# EAGLE design 3v3 (EAGLE 7.5.0)
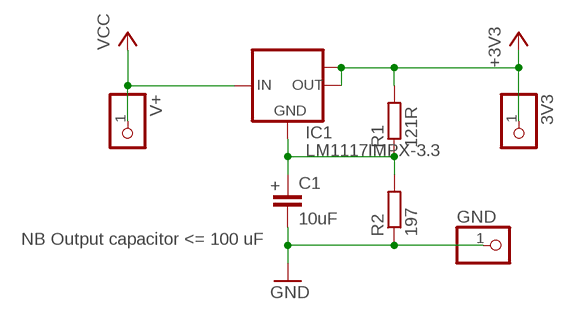
[diagram p0: schematic, sheet 1]

## Parts
3V3  PINHD-1X1  [1X01]
C1  10uF  C-EUC0805  [C0805]
GND  PINHD-1X1  [1X01]
IC1  LM1117IMPX-3.3  [SOT223]
R1  121R  R-EU_M0805  [M0805]
R2  197  R-EU_M0805  [M0805]
V+  PINHD-1X1  [1X01]

## Nets
+3V3: 3V3.1 IC1.2(OUT) IC1.TAB(OUT1) R1.2
GND: C1.2 GND.1 R2.1
N$2: C1.1 IC1.1(GND) R1.1 R2.2
VCC: IC1.3(IN) V+.1

## Notes on the sheet
- +
- NB Output capacitor <= 100 uF

## Library data of the parts
3V3 GND V+ = pinhead:PINHD-1X1: PIN HEADER
C1 = rcl:C-EU: CAPACITOR, European symbol
IC1 = lm1117:LM1117IMPX-*
R1 R2 = rcl:R-EU_: RESISTOR, European symbol

## Board
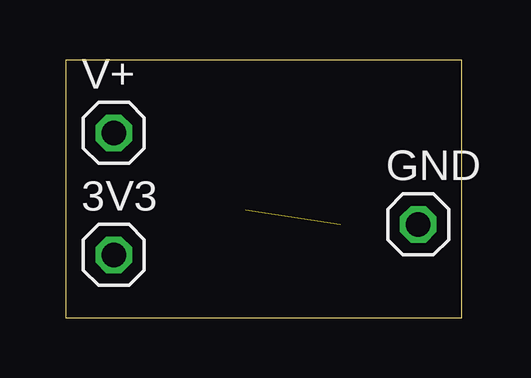
[diagram p1: board, top side]
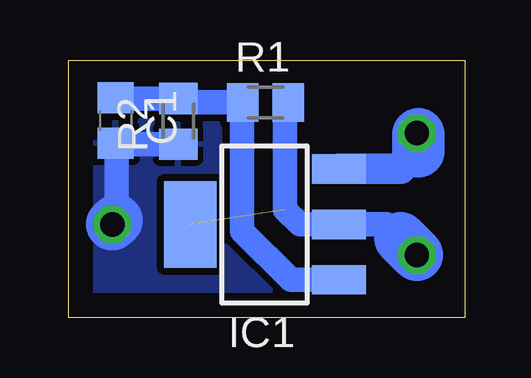
[diagram p2: board, bottom side, seen from below]

Size 16.53 x 10.73 mm. Coordinates in mm from the lower left corner, seen from the top.
Outline: 0,0 16.53,0 16.53,10.73 0,10.73 0,0
Copper layers (1*16): Top 0.035mm / dielectric 1.5mm / Bottom 0.035mm
Design rules "default *": minimum track width 10mil, minimum drill 24mil, track to track 12mil, track to pad 12mil, pad to pad 12mil, via to via 12mil, smd to smd 8mil, copper to edge 40mil, drill to drill 12mil, minimum pad ring 10mil, minimum via ring 8mil, stop-mask expansion 4mil, vias tented up to drill 0mil, thermal gap 10mil

### Footprints (pad centres in the part's own frame; a part is rotated, then mirrored left to right if it is on the bottom)
1X01 = drill 1.016 octagon: 1 0,0
C0805 = smd 1.3 x 1.5: 1 -0.95,0; 2 0.95,0
SOT223 = smd 1.219 x 2.235: 1 -2.311,-3.099; 2 0,-3.099; 3 2.311,-3.099 | smd 3.6 x 2.2: TAB 0,3.099
M0805 = smd 1.3 x 1.6: 1 -0.95,0; 2 0.95,0

### Placement (x,y rotation side)
3V3  2.01,2.61 0 top
C1  14.56,8.21 270 bottom
GND  14.71,3.88 0 top
IC1  8.36,3.88 90 bottom
R1  8.32,8.96 0 bottom
R2  11.96,8.18 90 bottom
V+  2.01,7.69 0 top

### Tracks (layer width: path | path; a pad name or v marks a point on that pad's centre or on a via)
+3V3  (1 unrouted)
  Bottom 1.016: R1.2 7.5,8.83 7.5,4.5 6.88,3.88 IC1.2 3.28,3.88 2.7,3.3
  Bottom 2.184: 3V3.1 2.7,3.3
GND
  Bottom 1.016: R2.1 14.53,7.22 | 14.53,7.22 C1.2 | 14.53,7.22 14.53,4.06
  Bottom 2.184: 14.53,4.06 GND.1
  pour Bottom: 0,0 0,10.8 16.5,10.8 16.5,0
N$2
  Bottom 1.016: IC1.1 7.27,1.57 9.3,3.6 9.3,8.93 R1.1 11.79,8.96 R2.2 14.53,9.12 C1.1
VCC
  Bottom 1.27: IC1.3 2.68,6.19 1.95,6.92 | 1.95,7.63 V+.1
  Bottom 2.184: 1.95,6.92 1.95,7.63